# Altium schematic sheet LPCB218 - INTERNAL PRESSURE.SchDoc
size A3; Address1: Factory 10; Address2: 9-13 Dingley Avenue, Dandeong, VICTORIA 3175, AUSTRALIA; DocumentNumber: 9; Revision: 1; SheetNumber: 9; SheetTotal: 14; Lockie__PCB_SUB_ASSEMBLY: Internal Pressure; Lockie__PCB_ASSEMBLY: Command Node; Lockie__LDL: LPCB218; Lockie__PCB_DESCRIPTION: Command Node
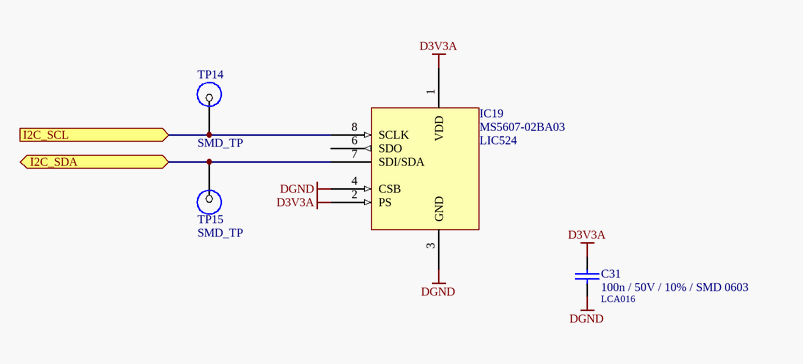
[diagram p0: LPCB218 - INTERNAL PRESSURE.SchDoc]

## Parts
C31  100n / 50V / 10% / SMD 0603  LDL_NUMBER: LCA016  [LFP011__CC1608-0603-IPC7351_B]
IC19  MS5607-02BA03  LDL_NUMBER: LIC524  [LFP140__QFN8]
TP14  SMD_TP  [SMD-TP]  (no BOM)
TP15  SMD_TP  [SMD-TP]  (no BOM)

## Ports
I2C_SCL (in), I2C_SDA (bidir)

## Nets
D3V3A: C31.1 IC19.1(VDD) IC19.2(PS)
DGND: C31.2 IC19.3(GND) IC19.4(CSB)
I2C_SCL: IC19.8(SCLK) TP14.1 ; port I2C_SCL
I2C_SDA: IC19.7(SDI/SDA) TP15.1 ; port I2C_SDA

Not connected (* = marked no-connect by the designer): IC19 6(SDO)

## Notes on the sheet
- PCB COMPONENT DESCRIPTION
- LDL NUMBER
- Assembly Details
- Size
- Drawing File Name
- Revision
- http://rloop.org
- Scale
- A3
- Sheet Details
- N.T.S
- Sheet:
- Of:

## Library data of the parts
C31 = 100n / 50V / 10% / SMD 0603: Capacitor, Ceramic Chip, 100nF (0.1uF), 50V, 5%, SMD 0603 [LCA016]; FMEDA__OPERATING__VOLTAGE_MIN: 0; FMEDA__OPERATING__VOLTAGE_MAX: 3.3; FMEDA__OPERATING__TEMP_MIN: -20; FMEDA__OPERATING__TEMP_TYP: 27; FMEDA__OPERATING__TEMP_MAX: 50; FMEDA__CHANNEL: COM; Value: 100n; FMEDA__FUNCTION_IN_SYSTEM: *; FMEDA__OPERATING__VOLTAGE_TYP: 3.3
IC19 = MS5607-02BA03: IC, Pressure Sensor IC, SMD QFN8 [LIC524]
TP14 TP15 = SMD_TP: SMD Test Point; FMEDA__CHANNEL: COM; FMEDA__OPERATING__CURRENT_MAX: 0; FMEDA__OPERATING__TEMP_MAX: 50; FMEDA__OPERATING__TEMP_MIN: -20; FMEDA__OPERATING__TEMP_TYP: 27; FMEDA__OPERATING__VOLTAGE_MAX: 16; FMEDA__OPERATING__VOLTAGE_TYP: 12; FMEDA__OPERATING__CURRENT_MIN: 0; FMEDA__OPERATING__CURRENT_TYP: 0; FMEDA__OPERATING__VOLTAGE_MIN: 0